# EAGLE design Edgy (EAGLE 9.0.0)
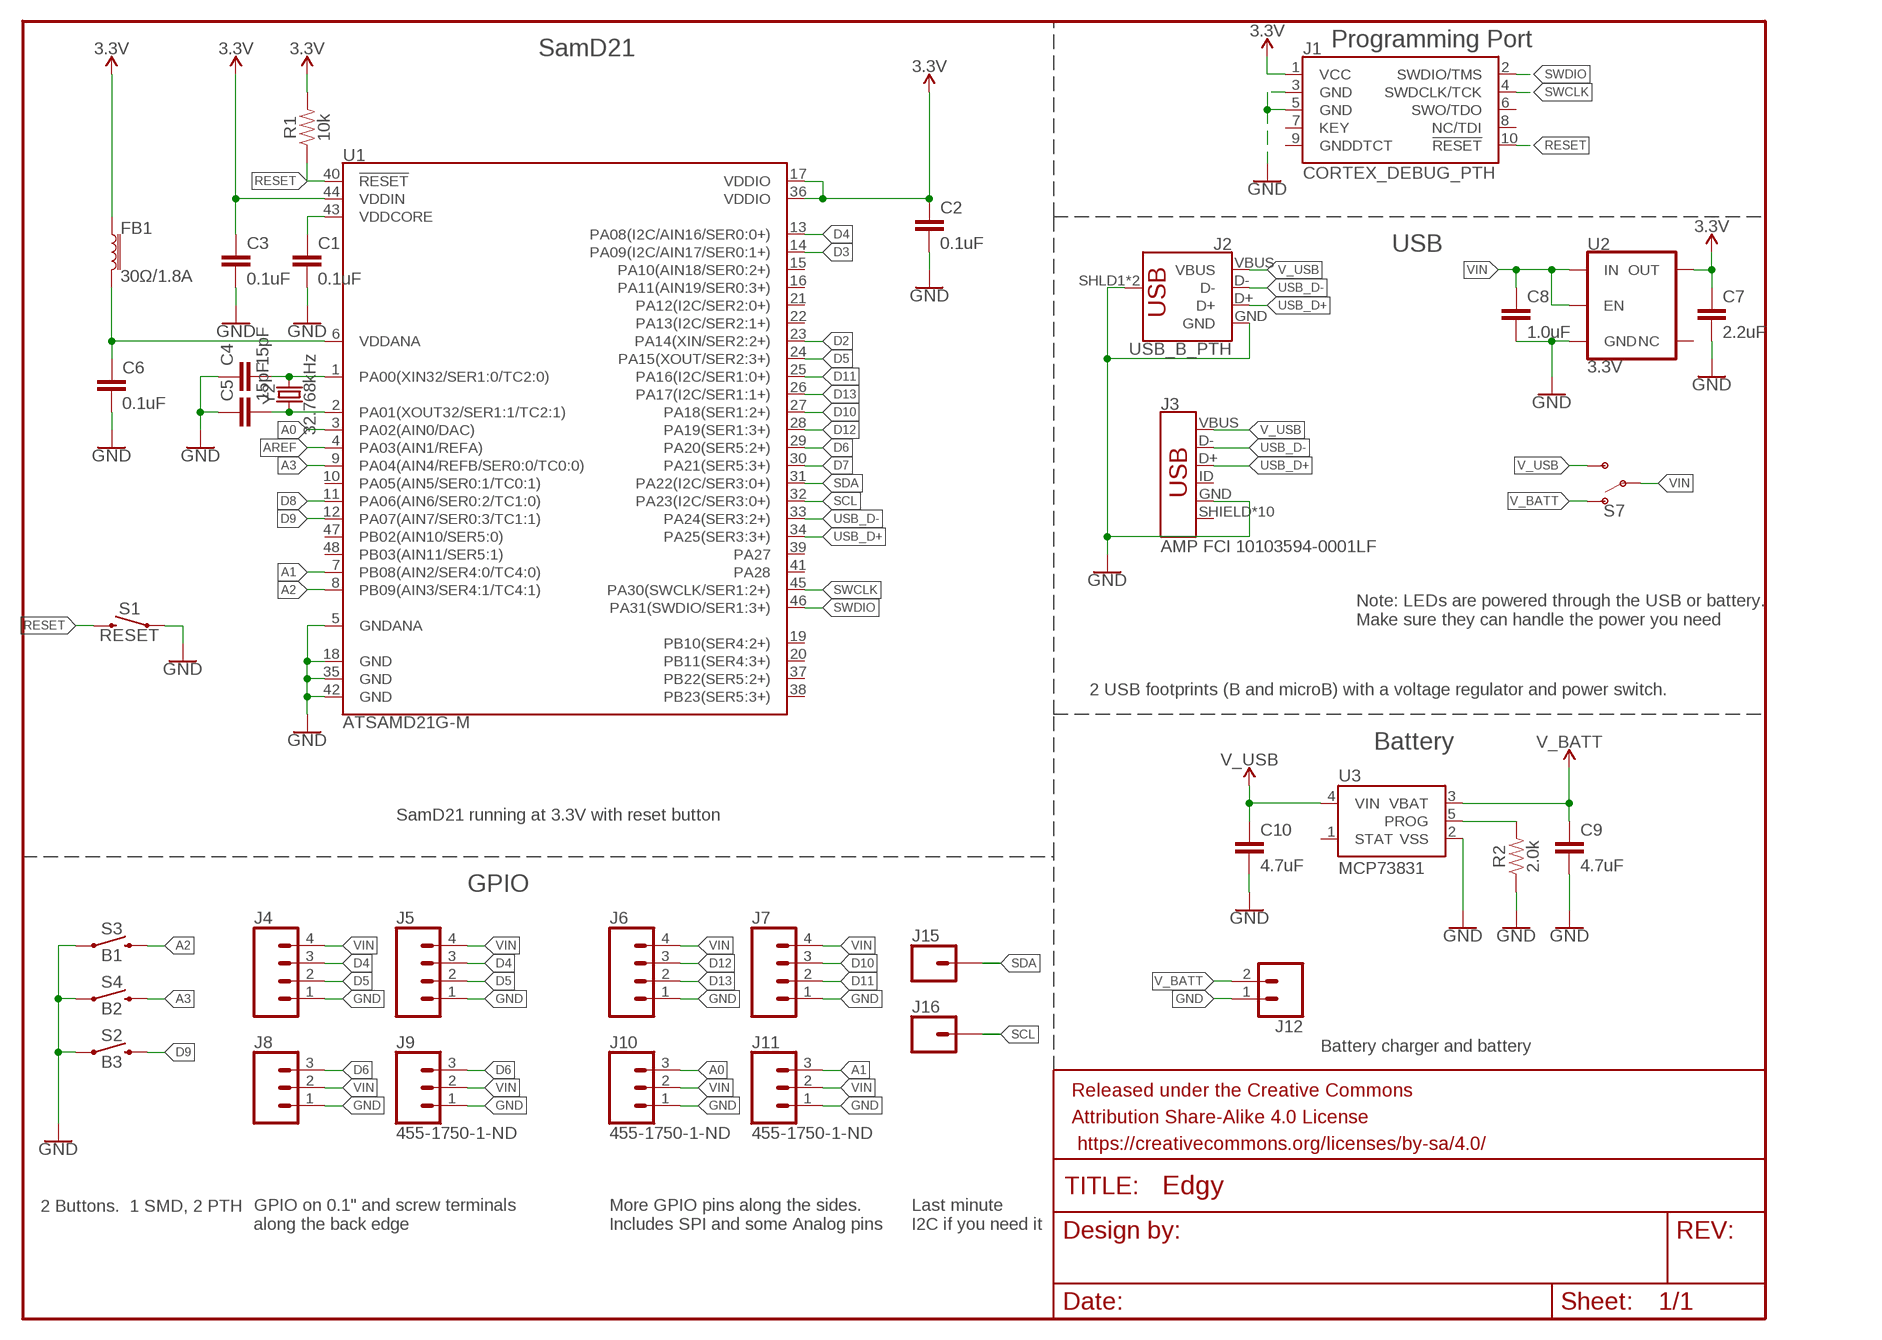
[diagram p0: schematic, sheet 1]

## Parts
C1  0.1uF  0.1UF-0402-16V-10%  [0402]
C2  0.1uF  0.1UF-0402-16V-10%  [0402]
C3  0.1uF  0.1UF-0402-16V-10%  [0402]
C4  15pF  15PF-0402-50V-5%  [0402]
C5  15pF  15PF-0402-50V-5%  [0402]
C6  0.1uF  0.1UF-0402-16V-10%  [0402]
C7  2.2uF  2.2UF-0603-10V-20%  [0603]
C8  1.0uF  1.0UF-0402-16V-10%  [0402]
C9  4.7uF  4.7UF-0603-6.3V-(10%)  [0603]
C10  4.7uF  4.7UF-0603-6.3V-(10%)  [0603]
FB1  30Ω/1.8A  FERRITE_BEAD-0603  [0603]
FRAME1  FRAME-LETTER  [CREATIVE_COMMONS]
J1  CORTEX_DEBUG_PTH  [2X5-PTH-1.27MM]
J2  USB_B_PTH  [USB-B-PTH]
J3  AMP FCI 10103594-0001LF  USB_MICRO-B_HALF_PTH_MILL  [USB-MICROB-PTH-MILL]
J4  CONN_04SCREW  [SCREWTERMINAL-3.5MM-4]
J5  CONN_04  [1X04]
J6  CONN_04  [1X04]
J7  CONN_04  [1X04]
J8  CONN_03SCREW  [SCREWTERMINAL-3.5MM-3]
J9  455-1750-1-ND  CONN_03  [1X03]
J10  455-1750-1-ND  CONN_03  [1X03]
J11  455-1750-1-ND  CONN_03  [1X03]
J12  CONN_02-JST-2MM-SMT  [JST-2-SMD]
J15  CONN_01  [1X01]
J16  CONN_01  [1X01]
R1  10k  10KOHM-0603-1/10W-1%  [0603]
R2  2.0k  2.0KOHM-0603-1/10W-5%  [0603]
S1  RESET  MOMENTARY-SWITCH-SPST-SMD-6.0X3.5MM  [TACTILE_SWITCH_SMD_6.0X3.5MM]
S2  B3  MOMENTARY-SWITCH-SPST-SMD-6.0X3.5MM  [TACTILE_SWITCH_SMD_6.0X3.5MM]
S3  B1  MOMENTARY-SWITCH-SPST-PTH-RIGHT-ANGLE-KIT  [TACTILE_SWITCH_PTH_RIGHT_ANGLE_KIT]
S4  B2  MOMENTARY-SWITCH-SPST-PTH-RIGHT-ANGLE-KIT  [TACTILE_SWITCH_PTH_RIGHT_ANGLE_KIT]
S7  SWITCH-SPDT-PTH-11.6X4.0MM  [SWITCH_SPDT_PTH_11.6X4.0MM]
U1  ATSAMD21G-M  [QFN-48]
U2  3.3V  V_REG_AP2112K-3.3V  [SOT23-5]
U3  MCP73831  [SOT23-5]
Y2  32.768kHz  CRYSTAL-32.768KHZSMD-3.2X1.5  [CRYSTAL-SMD-3.2X1.5MM]

## Nets
3.3V: C2.1 C3.1 C7.1 FB1.1 J1.1(VCC) R1.2 U1.17(VDDIO) U1.36(VDDIO) U1.44(VDDIN) U2.5(OUT)
A0: J10.3 U1.3(PA02(AIN0/DAC))
A1: J11.3 U1.7(PB08(AIN2/SER4:0/TC4:0))
A2: S3.2 U1.8(PB09(AIN3/SER4:1/TC4:1))
A3: S4.2 U1.9(PA04(AIN4/REFB/SER0:0/TC0:0))
AREF: U1.4(PA03(AIN1/REFA))
D2: U1.23(PA14(XIN/SER2:2+))
D3: U1.14(PA09(I2C/AIN17/SER0:1+))
D4: J4.3 J5.3 U1.13(PA08(I2C/AIN16/SER0:0+))
D5: J4.2 J5.2 U1.24(PA15(XOUT/SER2:3+))
D6: J8.3 J9.3 U1.29(PA20(SER5:2+))
D7: U1.30(PA21(SER5:3+))
D8: U1.11(PA06(AIN6/SER0:2/TC1:0))
D9: S2.2 U1.12(PA07(AIN7/SER0:3/TC1:1))
D10: J7.3 U1.27(PA18(SER1:2+))
D11: J7.2 U1.25(PA16(I2C/SER1:0+))
D12: J6.3 U1.28(PA19(SER1:3+))
D13: J6.2 U1.26(PA17(I2C/SER1:1+))
GND: C1.2 C2.2 C3.2 C4.1 C5.1 C6.2 C7.2 C8.2 C9.2 C10.2 J1.3(GND) J1.5(GND) J2.GND J2.SHLD1(SHIELD) J2.SHLD2(SHIELD) J3.GND J4.1 J5.1 J6.1 J7.1 J8.1 J9.1 J10.1 J11.1 J12.1 R2.1 S1.1 S2.1 S3.1 S4.1 U1.5(GNDANA) U1.18(GND) U1.35(GND) U1.42(GND) U2.2(GND) U3.2(VSS)
N$1: R2.2 U3.5(PROG)
N$2: C6.1 FB1.2 U1.6(VDDANA)
N$3: C1.1 U1.43(VDDCORE)
N$4: C4.2 U1.1(PA00(XIN32/SER1:0/TC2:0)) Y2.P$2
N$5: C5.2 U1.2(PA01(XOUT32/SER1:1/TC2:1)) Y2.P$1
RESET: J1.10(!RESET) R1.1 S1.2 U1.40(!RESET!)
SCL: J16.1 U1.32(PA23(I2C/SER3:0+))
SDA: J15.1 U1.31(PA22(I2C/SER3:0+))
SWCLK: J1.4(SWDCLK/TCK) U1.45(PA30(SWCLK/SER1:2+))
SWDIO: J1.2(SWDIO/TMS) U1.46(PA31(SWDIO/SER1:3+))
USB_D+: J2.D+ J3.D+ U1.34(PA25(SER3:3+))
USB_D-: J2.D- J3.D- U1.33(PA24(SER3:2+))
V_BATT: C9.1 J12.2 S7.1(O) U3.3(VBAT)
V_USB: C10.1 J2.VBUS J3.VBUS S7.3(S) U3.4(VIN)
VIN: C8.1 J4.4 J5.4 J6.4 J7.4 J8.2 J9.2 J10.2 J11.2 S7.2(P) U2.1(IN) U2.3(EN)
Unconnected: J1.6(SWO/TDO) J1.7(KEY) J1.8(NC/TDI) J1.9(GNDDTCT) J3.ID J3.SHIELD J3.SHIELD2(SHIELD) J3.SHIELD3(SHIELD) J3.SHIELD4(SHIELD) J3.SHIELD5(SHIELD) J3.SHIELD6(SHIELD) J3.SHIELD7(SHIELD) J3.SHIELD8(SHIELD) J3.SHIELD9(SHIELD) J3.SHIELD10(SHIELD) U1.10(PA05(AIN5/SER0:1/TC0:1)) U1.15(PA10(AIN18/SER0:2+)) U1.16(PA11(AIN19/SER0:3+)) U1.19(PB10(SER4:2+)) U1.20(PB11(SER4:3+)) U1.21(PA12(I2C/SER2:0+)) U1.22(PA13(I2C/SER2:1+)) U1.37(PB22(SER5:2+)) U1.38(PB23(SER5:3+)) U1.39(PA27) U1.41(PA28) U1.47(PB02(AIN10/SER5:0)) U1.48(PB03(AIN11/SER5:1)) U2.4(NC) U3.1(STAT)

## Notes on the sheet
- Programming Port
- SamD21
- USB
- Note: LEDs are powered through the USB or battery.  
  Make sure they can handle the power you need
- 2 USB footprints (B and microB) with a voltage regulator and power switch.
- Battery
- SamD21 running at 3.3V with reset button
- GPIO
- Battery charger and battery
- 2 Buttons.  1 SMD, 2 PTH
- GPIO on 0.1" and screw terminals 
  along the back edge
- More GPIO pins along the sides.
  Includes SPI and some Analog pins
- Last minute 
  I2C if you need it

## Library data of the parts
C1-C3 C6 = SparkFun-Capacitors:0.1UF: 0.1µF ceramic capacitors A capacitor is a passive two-terminal electrical component used to store electrical energy temporarily in an electric field.; PROD_ID: CAP-12416
C4 C5 = SparkFun-Capacitors:15PF: 15pF ceramic capacitors A capacitor is a passive two-terminal electrical component used to store electrical energy temporarily in an electric field.; PROD_ID: CAP-13063
C7 = SparkFun-Capacitors:2.2UF: 2.2µF ceramic capacitors A capacitor is a passive two-terminal electrical component used to store electrical energy temporarily in an electric field.; PROD_ID: CAP-07888
C8 = SparkFun-Capacitors:1.0UF: 1µF ceramic capacitors A capacitor is a passive two-terminal electrical component used to store electrical energy temporarily in an electric field.; PROD_ID: CAP-12417
C9 C10 = SparkFun-Capacitors:4.7UF: 4.7µF ceramic capacitors A capacitor is a passive two-terminal electrical component used to store electrical energy temporarily in an electric field.; PROD_ID: CAP-08280
FB1 = SparkFun-Coils:FERRITE_BEAD: Ferrite Bead (blocks, cores, rings, chokes, etc.) Inductor with layers of ferrite used to suppress high frequencies. Often used to isolate high frequency noise. SparkFun Products: IOIO-OTG - V2.2 <https://www.sparkfun.com/products/13613> SparkFun SAMD21 Mini Breakout <https://www.sparkfun.com/products/13664> SparkFun 6 Degrees of Freedom Breakout - LSM6DS3 <https://www.sparkfun.com/products/13339> SparkFun SAMD21 Dev Breakout <https://www.sparkfun.com/products/13672>; PROD_ID: NDUC-13805
FRAME1 = SparkFun-Aesthetics:FRAME-LETTER: Schematic Frame - Letter Standard 8.5x11 US Letter frame
J1 = SparkFun-Connectors:CORTEX_DEBUG: Cortex Debug Connector - 10 pin Supports JTAG debug, Serial Wire debug, and Serial Wire Viewer. PTH and SMD connector options available. General Connector Information <http://infocenter.arm.com/help/topic/com.arm.doc.faqs/attached/13634/cortex_debug_connectors.pdf> Products: PTH Connector <http://www.digikey.com/product-detail/en/cnc-tech/3220-10-0100-00/1175-1627-ND/3883661> -via Digi-Key SparkFun PSoc <https://www.sparkfun.com/products/13229> SparkFun T <https://www.sparkfun.com/products/13810>
J2 = SparkFun-Connectors:USB_B: USB Type B Connector SparkFun Products: SparkFun Stepoko <https://www.sparkfun.com/products/13899> PTH; PROD_ID: CONN-08278; SF_ID: PRT-00139
J3 = SparkFun-Connectors:USB_MICRO-B: USB Type Micro-B Connector Male/female and PTH/SMT variants SparkFun Products: SparkFun microB USB Breakout <https://www.sparkfun.com/products/12035> SparkFun USB microB Plug Breakout <https://www.sparkfun.com/products/10031> SparkFun ESP8266 Thing <https://www.sparkfun.com/products/13231>; PROD_ID: CONN-13711
J4 = SparkFun-Connectors:CONN_04: Multi connection point. Often used as Generic Header-pin footprint for 0.1 inch spaced/style header connections On any of the 0.1 inch spaced packages, you can populate with these: Break Away Headers - Straight <https://www.sparkfun.com/products/116> (PRT-00116) Break Away Male Headers - Right Angle <https://www.sparkfun.com/products/553> (PRT-00553) Female Headers <https://www.sparkfun.com/products/115> (PRT-00115) Break Away Headers - Machine Pin <https://www.sparkfun.com/products/117> (PRT-00117) Break Away Female Headers - Swiss Machine Pin <https://www.sparkfun.com/products/743> (PRT-00743) For SCREWTERMINALS and SPRING TERMINALS visit here: Screw Terimnals on SparkFun.com <https://www.sparkfun.com/search/results?term=Screw+Terminals> (5mm/3.5mm/2.54mm spacing) This device is also useful as a general connection point to wire up your design to another part of your project. Our various solder wires solder well into these plated through hole pads. Hook-Up Wire - Assortment (Stranded, 22 AWG) <https://www.sparkfun.com/products/11375> (PRT-11375) Hook-Up Wire - Assortment (Solid Core, 22 AWG) <https://www.sparkfun.com/products/11367> (PRT-11367) View the entire wire category on our website here <https://www.sparkfun.com/categories/141> Special notes: Molex polarized connector foot print use with SKU : PRT-08231 with associated crimp pins and housings. 1MM SMD Version SKU: PRT-10208; PROD_ID: 2xCONN-08399; SF_ID: 2xPRT-08084
J5-J7 = SparkFun-Connectors:CONN_04: Multi connection point. Often used as Generic Header-pin footprint for 0.1 inch spaced/style header connections On any of the 0.1 inch spaced packages, you can populate with these: Break Away Headers - Straight <https://www.sparkfun.com/products/116> (PRT-00116) Break Away Male Headers - Right Angle <https://www.sparkfun.com/products/553> (PRT-00553) Female Headers <https://www.sparkfun.com/products/115> (PRT-00115) Break Away Headers - Machine Pin <https://www.sparkfun.com/products/117> (PRT-00117) Break Away Female Headers - Swiss Machine Pin <https://www.sparkfun.com/products/743> (PRT-00743) For SCREWTERMINALS and SPRING TERMINALS visit here: Screw Terimnals on SparkFun.com <https://www.sparkfun.com/search/results?term=Screw+Terminals> (5mm/3.5mm/2.54mm spacing) This device is also useful as a general connection point to wire up your design to another part of your project. Our various solder wires solder well into these plated through hole pads. Hook-Up Wire - Assortment (Stranded, 22 AWG) <https://www.sparkfun.com/products/11375> (PRT-11375) Hook-Up Wire - Assortment (Solid Core, 22 AWG) <https://www.sparkfun.com/products/11367> (PRT-11367) View the entire wire category on our website here <https://www.sparkfun.com/categories/141> Special notes: Molex polarized connector foot print use with SKU : PRT-08231 with associated crimp pins and housings. 1MM SMD Version SKU: PRT-10208; PROD_ID: CONN-09696
J8 = SparkFun-Connectors:CONN_03: Multi connection point. Often used as Generic Header-pin footprint for 0.1 inch spaced/style header connections On any of the 0.1 inch spaced packages, you can populate with these: Break Away Headers - Straight <https://www.sparkfun.com/products/116> (PRT-00116) Break Away Male Headers - Right Angle <https://www.sparkfun.com/products/553> (PRT-00553) Female Headers <https://www.sparkfun.com/products/115> (PRT-00115) Break Away Headers - Machine Pin <https://www.sparkfun.com/products/117> (PRT-00117) Break Away Female Headers - Swiss Machine Pin <https://www.sparkfun.com/products/743> (PRT-00743) Stackable Header - 3 Pin (Female, 0.1") <https://www.sparkfun.com/products/13875> (PRT-13875) For SCREWTERMINALS and SPRING TERMINALS visit here: Screw Terimnals on SparkFun.com <https://www.sparkfun.com/search/results?term=Screw+Terminals> (5mm/3.5mm/2.54mm spacing) This device is also useful as a general connection point to wire up your design to another part of your project. Our various solder wires solder well into these plated through hole pads. Hook-Up Wire - Assortment (Stranded, 22 AWG) <https://www.sparkfun.com/products/11375> (PRT-11375) Hook-Up Wire - Assortment (Solid Core, 22 AWG) <https://www.sparkfun.com/products/11367> (PRT-11367) View the entire wire category on our website here <https://www.sparkfun.com/categories/141> Special notes: Molex polarized connector foot print use with SKU : PRT-08232 with associated crimp pins and housings.; PROD_ID: CONN-08288; SF_ID: PRT-08235
J9-J11 = SparkFun-Connectors:CONN_03: Multi connection point. Often used as Generic Header-pin footprint for 0.1 inch spaced/style header connections On any of the 0.1 inch spaced packages, you can populate with these: Break Away Headers - Straight <https://www.sparkfun.com/products/116> (PRT-00116) Break Away Male Headers - Right Angle <https://www.sparkfun.com/products/553> (PRT-00553) Female Headers <https://www.sparkfun.com/products/115> (PRT-00115) Break Away Headers - Machine Pin <https://www.sparkfun.com/products/117> (PRT-00117) Break Away Female Headers - Swiss Machine Pin <https://www.sparkfun.com/products/743> (PRT-00743) Stackable Header - 3 Pin (Female, 0.1") <https://www.sparkfun.com/products/13875> (PRT-13875) For SCREWTERMINALS and SPRING TERMINALS visit here: Screw Terimnals on SparkFun.com <https://www.sparkfun.com/search/results?term=Screw+Terminals> (5mm/3.5mm/2.54mm spacing) This device is also useful as a general connection point to wire up your design to another part of your project. Our various solder wires solder well into these plated through hole pads. Hook-Up Wire - Assortment (Stranded, 22 AWG) <https://www.sparkfun.com/products/11375> (PRT-11375) Hook-Up Wire - Assortment (Solid Core, 22 AWG) <https://www.sparkfun.com/products/11367> (PRT-11367) View the entire wire category on our website here <https://www.sparkfun.com/categories/141> Special notes: Molex polarized connector foot print use with SKU : PRT-08232 with associated crimp pins and housings.; PROD_ID: XXX-00000
J12 = SparkFun-Connectors:CONN_02: Multi connection point. Often used as Generic Header-pin footprint for 0.1 inch spaced/style header connections On any of the 0.1 inch spaced packages, you can populate with these: Break Away Headers - Straight <https://www.sparkfun.com/products/116> (PRT-00116) Break Away Male Headers - Right Angle <https://www.sparkfun.com/products/553> (PRT-00553) Female Headers <https://www.sparkfun.com/products/115> (PRT-00115) Break Away Headers - Machine Pin <https://www.sparkfun.com/products/117> (PRT-00117) Break Away Female Headers - Swiss Machine Pin <https://www.sparkfun.com/products/743> (PRT-00743) For SCREWTERMINALS and SPRING TERMINALS visit here: Screw Terimnals on SparkFun.com <https://www.sparkfun.com/search/results?term=Screw+Terminals> (5mm/3.5mm/2.54mm spacing) This device is also useful as a general connection point to wire up your design to another part of your project. Our various solder wires solder well into these plated through hole pads. Hook-Up Wire - Assortment (Stranded, 22 AWG) <https://www.sparkfun.com/products/11375> (PRT-11375) Hook-Up Wire - Assortment (Solid Core, 22 AWG) <https://www.sparkfun.com/products/11367> (PRT-11367) View the entire wire category on our website here <https://www.sparkfun.com/categories/141> Special notes: Molex polarized connector foot print use with: PRT-08233 with associated crimp pins and housings. 2.54_SCREWTERM for use with PRT-10571. 3.5mm Screw Terminal footprints for PRT-08084 5mm Screw Terminal footprints for use with PRT-08432; PROD_ID: CONN-11443
J15 J16 = SparkFun-Connectors:CONN_01: Single connection point. Often used as Generic Header-pin footprint for 0.1 inch spaced/style header connections On any of the 0.1 inch spaced packages, you can populate with these: Break Away Headers - Straight <https://www.sparkfun.com/products/116> (PRT-00116) Break Away Male Headers - Right Angle <https://www.sparkfun.com/products/553> (PRT-00553) Female Headers <https://www.sparkfun.com/products/115> (PRT-00115) Break Away Headers - Machine Pin <https://www.sparkfun.com/products/117> (PRT-00117) Break Away Female Headers - Swiss Machine Pin <https://www.sparkfun.com/products/743> (PRT-00743) This device is also useful as a general connection point to wire up your design to another part of your project. Our various solder wires solder well into these plated through hole pads. Hook-Up Wire - Assortment (Stranded, 22 AWG) <https://www.sparkfun.com/products/11375> (PRT-11375) Hook-Up Wire - Assortment (Solid Core, 22 AWG) <https://www.sparkfun.com/products/11367> (PRT-11367) View the entire wire category on our website here <https://www.sparkfun.com/categories/141> Special notes: SMTSO-256-ET is a "flush mount" nut for a 4-40 screw. We mostly use this on specialty testbeds; it is a nice way to connect hardware to your PCB at an adjustable hieght. Also note, the SNAP packages are for using a snappable style connector. We sell a baggie of snaps and they are also used on two LilyPad designs: Snap Assortment - 30 pack (male and female) <https://www.sparkfun.com/products/11347> (DEV-11347) LilyPad Arduino SimpleSnap <https://www.sparkfun.com/products/10941> (DEV-10941) LilyPad SimpleSnap Protoboard <https://www.sparkfun.com/products/10940> (DEV-10940)
R1 = SparkFun-Resistors:10KOHM: 10kΩ resistor A resistor is a passive two-terminal electrical component that implements electrical resistance as a circuit element. Resistors act to reduce current flow, and, at the same time, act to lower voltage levels within circuits. - Wikipedia; PROD_ID: RES-00824
R2 = SparkFun-Resistors:2.0KOHM: 2kΩ resistor A resistor is a passive two-terminal electrical component that implements electrical resistance as a circuit element. Resistors act to reduce current flow, and, at the same time, act to lower voltage levels within circuits. - Wikipedia; PROD_ID: RES-08296
S1 S2 = SparkFun-Switches:MOMENTARY-SWITCH-SPST: Momentary Switch (Pushbutton) - SPST Normally-open (NO) SPST momentary switches (buttons, pushbuttons). Variants PTH-12MM - 12mm square, through-hole Momentary Pushbutton Switch - 12mm Square <https://www.sparkfun.com/products/9190> (COM-09190) PTH-6.0MM, PTH-6.0MM-KIT - 6.0mm square, through-hole Mini Pushbutton Switch <https://www.sparkfun.com/products/97> (COM-00097) KIT package intended for soldering kit's - only one side of pads' copper is exposed. PTH-RIGHT-ANGLE-KIT - Right-angle, through-hole Right Angle Tactile Button <https://www.sparkfun.com/products/10791> - Used on SparkFun BigTime Watch Kit <https://www.sparkfun.com/products/11734> SMD-12MM - 12mm square, surface-mount Tactile Button - SMD (12mm) <https://www.sparkfun.com/products/12993> (COM-12993) Used on SparkFun PicoBoard <https://www.sparkfun.com/products/11888> SMD-4.5MM - 4.5mm Square Trackball Switch Used on SparkFun Blackberry Trackballer Breakout <https://www.sparkfun.com/products/13169> SMD-4.6MMX2.8MM - 4.60mm x 2.80mm, surface mount Used on SparkFun SAMD21 Mini Breakout <https://www.sparkfun.com/products/13664> SMD-5.2MM, SMD-5.2-REDUNDANT - 5.2mm square, surface-mount Mini Pushbutton Switch - SMD <https://www.sparkfun.com/products/8720> (COM-08720) Used on Arduino Pro Mini <https://www.sparkfun.com/products/11114> REDUNDANT package connects both switch circuits together SMD-6.0X3.5MM - 6.0 x 3.5mm, surface mount Momentary Reset Switch SMD <https://www.sparkfun.com/products/8229> (COM-08229) SMD-6.2MM-TALL - 6.2mm square, surface mount Tactile Button - SMD (6mm) <https://www.sparkfun.com/products/12992> Used on SparkFun Digital Sandbox <https://www.sparkfun.com/products/12651> SMD-RIGHT-ANGLE - Right-angle, surface mount Used on SparkFun Block for Intel® Edison - Arduino <https://www.sparkfun.com/products/13036>; PROD_ID: SWCH-00815; SF_SKU: COM-08229
S3 S4 = SparkFun-Switches:MOMENTARY-SWITCH-SPST: Momentary Switch (Pushbutton) - SPST Normally-open (NO) SPST momentary switches (buttons, pushbuttons). Variants PTH-12MM - 12mm square, through-hole Momentary Pushbutton Switch - 12mm Square <https://www.sparkfun.com/products/9190> (COM-09190) PTH-6.0MM, PTH-6.0MM-KIT - 6.0mm square, through-hole Mini Pushbutton Switch <https://www.sparkfun.com/products/97> (COM-00097) KIT package intended for soldering kit's - only one side of pads' copper is exposed. PTH-RIGHT-ANGLE-KIT - Right-angle, through-hole Right Angle Tactile Button <https://www.sparkfun.com/products/10791> - Used on SparkFun BigTime Watch Kit <https://www.sparkfun.com/products/11734> SMD-12MM - 12mm square, surface-mount Tactile Button - SMD (12mm) <https://www.sparkfun.com/products/12993> (COM-12993) Used on SparkFun PicoBoard <https://www.sparkfun.com/products/11888> SMD-4.5MM - 4.5mm Square Trackball Switch Used on SparkFun Blackberry Trackballer Breakout <https://www.sparkfun.com/products/13169> SMD-4.6MMX2.8MM - 4.60mm x 2.80mm, surface mount Used on SparkFun SAMD21 Mini Breakout <https://www.sparkfun.com/products/13664> SMD-5.2MM, SMD-5.2-REDUNDANT - 5.2mm square, surface-mount Mini Pushbutton Switch - SMD <https://www.sparkfun.com/products/8720> (COM-08720) Used on Arduino Pro Mini <https://www.sparkfun.com/products/11114> REDUNDANT package connects both switch circuits together SMD-6.0X3.5MM - 6.0 x 3.5mm, surface mount Momentary Reset Switch SMD <https://www.sparkfun.com/products/8229> (COM-08229) SMD-6.2MM-TALL - 6.2mm square, surface mount Tactile Button - SMD (6mm) <https://www.sparkfun.com/products/12992> Used on SparkFun Digital Sandbox <https://www.sparkfun.com/products/12651> SMD-RIGHT-ANGLE - Right-angle, surface mount Used on SparkFun Block for Intel® Edison - Arduino <https://www.sparkfun.com/products/13036>; PROD_ID: CONN-10672; SF_SKU: COM-10791
S7 = SparkFun-Switches:SWITCH-SPDT: Single Pole, Double Throw (SPDT) Switch Single-pole, double-throw (SPDT) switch. Variant Overview SMD-AYZ0202 Surface Mount DPDT Switch <https://www.sparkfun.com/products/597> (COM-00597) Used on e.g. LilyPad Arduino USB - ATmega32U4 Board <https://www.sparkfun.com/products/12049> PTH-11.6X4.0MM SPDT Mini Power Switch <https://www.sparkfun.com/products/102> (COM-00102) Used on e.g. SparkFun Simon Says - Through-Hole Soldering Kit <https://www.sparkfun.com/products/10547> (KIT-10547) PTH-11.6X4.0MM-KIT KIT version of SPDT Mini Power Switch - Simplifies soldering by removing tStop of switch pins - only one side can be soldered. PTH-11.6X4.0MM-LOCK LOCK version of SPDT Mini Power Switch - Offset pins hold switch in place for easier soldering. SMD-RIGHT-ANGLE Surface Mount Right Angle Switch <https://www.sparkfun.com/products/10860> (COM-10860) Used on e.g. SparkFun ESP8266 Thing <https://www.sparkfun.com/products/13231>; PROD_ID: SWCH-08261; SF_SKU: COM-00102
U1 = SparkFun-IC-Microcontroller:ATSAMD21G: Atmel SAMD21G SMART ARM-Based Microcontroller The Atmel ® | SMART ™ SAM D21 is a series of low-power microcontrollers using the 32-bit ARM ® Cortex ® -M0+ processor, and ranging from 32- to 64-pins with up to 256KB Flash and 32KB of SRAM. The SAM D21 devices operate at a maximum frequency of 48MHz and reach 2.46 CoreMark/MHz. They are designed for simple and intuitive migration with identical peripheral modules, hex compatible code, identical linear address map and pin compatible migration paths between all devices in the product series. All devices include intelligent and flexible peripherals, Atmel Event System for inter-peripheral signaling, and support for capacitive touch button, slider and wheel user interfaces. Datasheet <https://cdn.sparkfun.com/datasheets/Dev/Arduino/Boards/Atmel-42181-SAM-D21_Datasheet.pdf> SparkFun Products SparkFun SAMD21 Mini Breakout <https://www.sparkfun.com/products/13664> (DEV-13664) SparkFun SAMD21 Dev Breakout <https://www.sparkfun.com/products/13672> (DEV-13672); PROD_ID: IC-13064
U2 = SparkFun-IC-Power:V_REG_AP2112: AP2112 - 600mA CMOS LDO Regulator w/ Enable The AP2112 is CMOS process low dropout linear regulator with enable function, the regulator delivers a guaranteed 600mA (min.) continuous load current. Features Output Voltage Accuracy: ±1.5% Output Current: 600mA (Min.) Foldback Short Current Protection: 50mA Enable Function to Turn ON/OFF VOUT Low Dropout Voltage (3.3V): 250mV (Typ.) @IOUT=600mA Excellent Load Regulation: 0.2%/A (Typ.) Excellent Line Regulation: 0.02%/V (Typ.) Low Quiescent Current: 55μA (Typ.) Low Standby Current: 0.01μA (Typ.) Low Output Noise: 50μVRMS PSRR: 100Hz -65dB, 1kHz -65dB OTSD Protection Stable with 1.0μF Flexible Cap: Ceramic, Tantalum and Aluminum Electrolytic Operation Temperature Range: -40°C to 85°C ESD: MM 400V, HBM 4000V; PROD_ID: VREG-12457
U3 = SparkFun-IC-Power:MCP73831: MCP73831T Li-Ion, Li-Pol Controller Miniature single cell, fully integrated Li-Ion, Li-polymer charge management controller Datasheet <http://ww1.microchip.com/downloads/en/DeviceDoc/20001984g.pdf> SparkFun Products: SparkFun ESP32 Thing <https://www.sparkfun.com/products/13907> SparkFun 9DoF Razor IMU M0 <https://www.sparkfun.com/products/14001>; PROD_ID: IC-09995
Y2 = SparkFun-Clocks:CRYSTAL-32.768KHZ: 32.768kHz Crystal Frequency: 32.768kHz Frequency Stability: ±20ppm Load Capacitance: 12.5pF (PTH-2X6 & SMD-3.2X1.5), 6pF (SMD-2X6) SparkFun Products: SparkFun BigTime Watch Kit <https://www.sparkfun.com/products/11734> SparkFun nRF52832 Breakout <https://www.sparkfun.com/products/13990> SparkFun Real Time Clock Module <https://www.sparkfun.com/products/12708>; PROD_ID: XTAL-13062

## Board
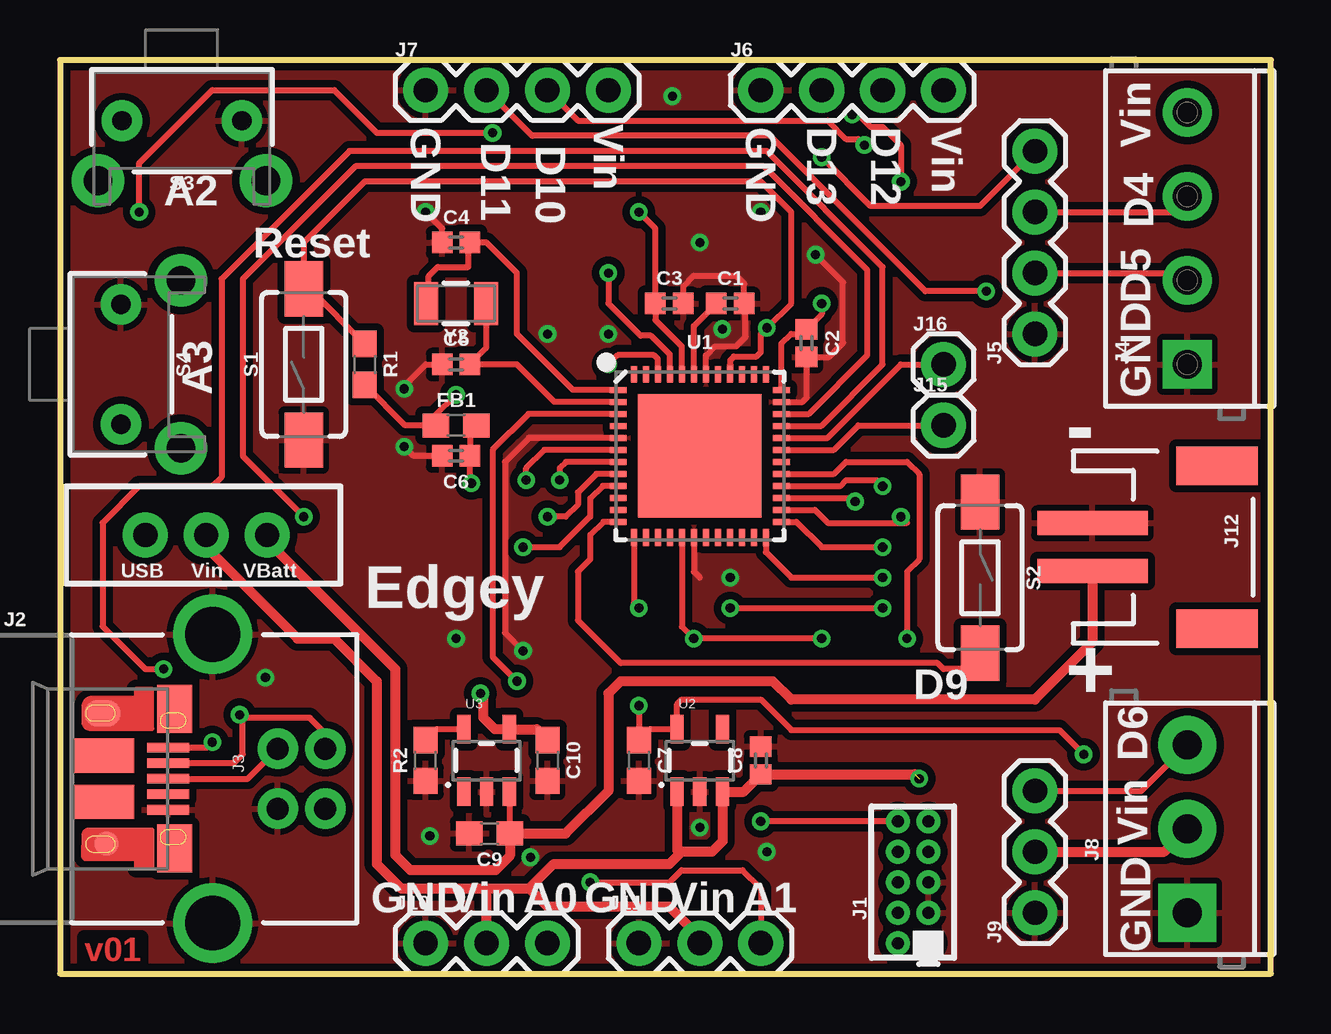
[diagram p1: board, top side]
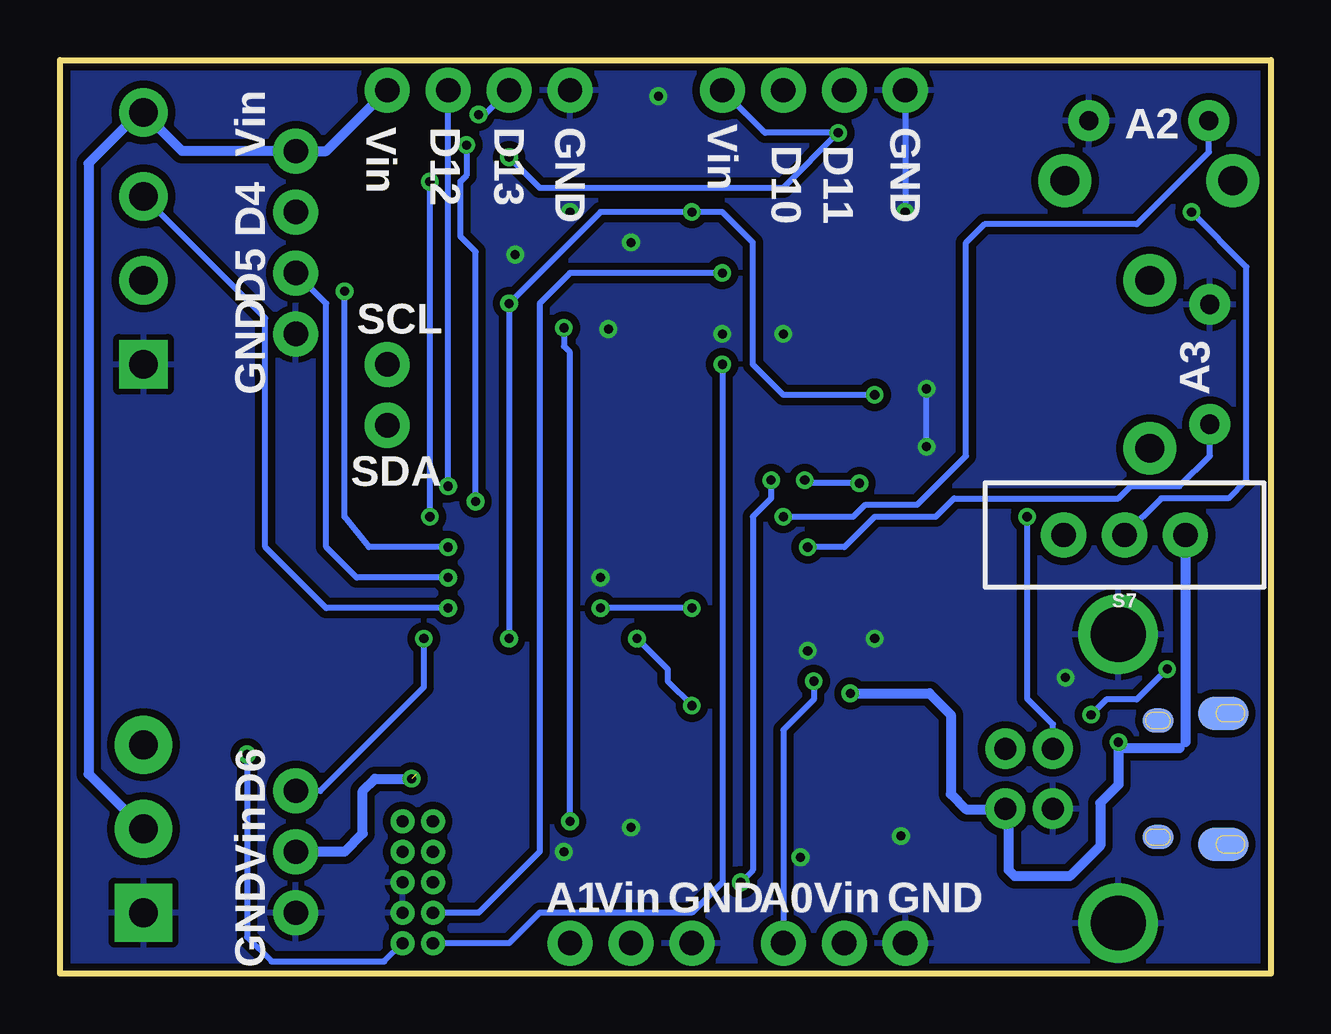
[diagram p2: board, bottom side, seen from below]

Size 50.47 x 38.09 mm. Coordinates in mm from the lower left corner, seen from the top.
Outline: 0,0 50.47,0 50.47,38.09 0,38.09 0,0
Copper layers (1*16): Top 0.035mm / dielectric 1.5mm / Bottom 0.035mm
Design rules "SparkFun-2-layer-TIGHT": minimum track width 7mil, minimum drill 15mil, track to track 7mil, track to pad 7mil, pad to pad 7mil, via to via 7mil, smd to smd 7mil, copper to edge 7mil, drill to drill 7mil, minimum pad ring 7mil, minimum via ring 7mil, stop-mask expansion 4mil, vias tented up to drill 25mil, thermal gap 10mil

### Footprints (pad centres in the part's own frame; a part is rotated, then mirrored left to right if it is on the bottom)
0402 = smd 0.85 x 0.9: 1 -0.58,0; 2 0.58,0
0603 = smd 1.1 x 1: 1 -0.85,0; 2 0.85,0
2X5-PTH-1.27MM = drill 0.508 pad 1: 1 -2.54,-0.635; 2 -2.54,0.635; 3 -1.27,-0.635; 4 -1.27,0.635; 5 0,-0.635; 6 0,0.635; 7 1.27,-0.635; 8 1.27,0.635; 9 2.54,-0.635; 10 2.54,0.635
USB-B-PTH = drill 0.914 pad 1.676: D+ 4,1.25; D- 5.981,1.25; GND 4,-1.25; VBUS 5.981,-1.25 | drill 2.286: SHLD1 1.282,-6.02; SHLD2 1.282,6.02
USB-MICROB-PTH-MILL = smd 0.4 x 1.75: D+ 0,0; D- -0.65,0; GND 1.3,0; ID 0.65,0; VBUS -1.3,0 | smd 2 x 1.46: SHIELD -2.9,0.275; SHIELD2 2.9,0.275 | smd 1.425 x 2.5: SHIELD3 -0.963,-2.675; SHIELD4 0.963,-2.675 | smd 1.4 x 2.1 bottom: SHIELD5 -2.731,-2.531; SHIELD7 2.729,-2.531 | smd 1 x 1: SHIELD6 2.7,-2.575 | smd 1.1 x 1.5: SHIELD8 -2.731,-2.731 | smd 1 x 1.3 bottom: SHIELD9 -2.43,0.195; SHIELD10 2.43,0.195
SCREWTERMINAL-3.5MM-4 = drill 1.2 pad 2.032 square: 1 0,0 | drill 1.2 pad 2.032: 2 3.5,0; 3 7,0; 4 10.5,0
1X04 = drill 1.016 pad 1.88: 1 0,0; 2 2.54,0; 3 5.08,0; 4 7.62,0
SCREWTERMINAL-3.5MM-3 = drill 1.2 pad 2.413 square: 1 0,0 | drill 1.2 pad 2.413: 2 3.5,0; 3 7,0
1X03 = drill 1.016 pad 1.88: 1 0,0; 2 2.54,0; 3 5.08,0
JST-2-SMD = smd 1 x 4.6: 1 -1,-3.7; 2 1,-3.7 | smd 1.6 x 3.4: NC1 -3.4,1.5; NC2 3.4,1.5
1X01 = drill 1.016 pad 1.88: 1 0,0
TACTILE_SWITCH_SMD_6.0X3.5MM = smd 2.3 x 1.6: 1 -3.15,0; 2 3.15,0
TACTILE_SWITCH_PTH_RIGHT_ANGLE_KIT = drill 0.8 pad 1.7: 1 -2.5,0; 2 2.5,0 | drill 1.2 pad 2.2: ANCHOR1 -3.5,2.5; ANCHOR2 3.5,2.5
SWITCH_SPDT_PTH_11.6X4.0MM = drill 1.016 pad 1.88: 1 0,2.54; 2 0,0; 3 0,-2.54
QFN-48 = smd 0.7 x 0.25: 1 -3.4,2.75; 2 -3.4,2.25; 3 -3.4,1.75; 4 -3.4,1.25; 5 -3.4,0.75; 6 -3.4,0.25; 7 -3.4,-0.25; 8 -3.4,-0.75; 9 -3.4,-1.25; 10 -3.4,-1.75; 11 -3.4,-2.25; 12 -3.4,-2.75; 25 3.4,-2.75; 26 3.4,-2.25; 27 3.4,-1.75; 28 3.4,-1.25; 29 3.4,-0.75; 30 3.4,-0.25; 31 3.4,0.25; 32 3.4,0.75; 33 3.4,1.25; 34 3.4,1.75; 35 3.4,2.25; 36 3.4,2.75 | smd 0.25 x 0.7: 13 -2.75,-3.4; 14 -2.25,-3.4; 15 -1.75,-3.4; 16 -1.25,-3.4; 17 -0.75,-3.4; 18 -0.25,-3.4; 19 0.25,-3.4; 20 0.75,-3.4; 21 1.25,-3.4; 22 1.75,-3.4; 23 2.25,-3.4; 24 2.75,-3.4; 37 2.75,3.4; 38 2.25,3.4; 39 1.75,3.4; 40 1.25,3.4; 41 0.75,3.4; 42 0.25,3.4; 43 -0.25,3.4; 44 -0.75,3.4; 45 -1.25,3.4; 46 -1.75,3.4; 47 -2.25,3.4; 48 -2.75,3.4 | smd 5.15 x 5.15: EP 0,0
SOT23-5 = smd 0.55 x 1.2: 1 -0.95,-1.3; 2 0,-1.3; 3 0.95,-1.3; 4 0.95,1.3; 5 -0.95,1.3
CRYSTAL-SMD-3.2X1.5MM = smd 1 x 1.8: P$1 -1.25,0; P$2 1.25,0

### Placement (x,y rotation side)
C1  27.94,27.94 0 top
C2  31.11,26.29 270 top
C3  25.4,27.94 0 top
C4  16.51,30.48 0 top
C5  16.51,25.4 0 top
C6  16.51,21.59 180 top
C7  24.13,8.89 270 top
C8  29.21,8.89 90 top
C9  17.91,5.84 180 top
C10  20.32,8.89 270 top
FB1  16.51,22.86 0 top
FRAME1  17.53,-13.46 0 top  (outside the outline)
J1  35.56,3.81 90 top
J2  5.08,8.13 0 top
J3  4.51,8.13 270 top
J4  46.99,25.4 90 top
J5  40.64,26.67 90 top
J6  29.21,36.83 0 top
J7  15.24,36.83 0 top
J8  46.99,2.54 90 top
J9  40.64,2.54 90 top
J10  15.24,1.27 0 top
J11  24.13,1.27 0 top
J12  46.74,17.78 270 top
J15  36.83,22.86 0 top
J16  36.83,25.4 0 top
R1  12.7,25.4 270 top
R2  15.24,8.89 90 top
S1  10.16,25.4 90 top
S2  38.35,16.51 270 top
S3  5.08,35.56 180 top
S4  2.54,25.4 270 top
S7  6.1,18.29 90 bottom
U1  26.67,21.59 0 top
U2  26.67,8.89 0 top
U3  17.78,8.89 0 top
Y2  16.51,27.94 180 top

### Tracks (layer width: path | path; a pad name or v marks a point on that pad's centre or on a via)
3.3V  (via drill 0.38)
  Top 0.254: R1.2 14.39,22.86 FB1.1 15.66,23.28 v16.51,24.13 | v31.75,27.94 31.75,27.5 C2.1 30.92,26.67 30.48,26.67 30.07,26.26 U1.36 | v24.13,31.75 24.82,31.06 C3.1 24.82,27.25 25.92,26.15 U1.44 | U1.17 25.92,14.47 v26.42,13.97 v31.75,13.97 | v24.13,11.18 C7.1 24.58,10.19 U2.5 25.72,11.24 25.91,11.43 29.21,11.43 30.48,10.16 41.66,10.16 v42.67,9.14
  Bottom 0.254: v16.51,24.13 20.32,24.13 21.59,25.4 21.59,30.48 22.86,31.75 v24.13,31.75 27.94,31.75 v31.75,27.94 v31.75,13.97 | v26.42,13.97 25.15,12.7 25.15,12.19 v24.13,11.18 | v42.67,9.14 42.67,1.52 41.66,0.51 36.96,0.51 J1.1
A0  (via drill 0.38)
  Top 0.254: U1.3 19.53,23.34 18.03,21.84 18.03,13.21 v19.05,12.19
  Bottom 0.254: J10.3 20.32,10.16 19.05,11.43 v19.05,12.19
A1  (via drill 0.38)
  Top 0.254: U1.7 21.09,21.34 20.83,21.08 v20.83,20.57 | v22.1,3.81 25.4,3.81 25.91,4.32 28.45,4.32 29.21,3.56 J11.3
  Bottom 0.254: v20.83,20.57 20.83,19.81 21.59,19.05 21.59,4.32 v22.1,3.81
A2  (via drill 0.38)
  Top 0.254: U1.8 22.36,20.84 21.59,20.07 21.59,19.56 21.08,19.05 v20.32,19.05
  Bottom 0.254: v20.32,19.05 17.4,19.05 16.89,19.56 14.73,19.56 12.7,21.59 12.7,30.48 11.94,31.24 5.59,31.24 2.58,34.25 S3.2
A3  (via drill 0.38)
  Top 0.254: U1.9 22.63,20.34 22.1,19.81 22.1,19.05 20.83,17.78 v19.3,17.78
  Bottom 0.254: S4.2 2.54,21.59 3.81,20.32 5.84,20.32 6.35,19.81 13.21,19.81 13.97,19.05 16.51,19.05 17.78,17.78 v19.3,17.78
D4  (via drill 0.38)
  Top 0.254: J5.3 46.34,31.75 J4.3 | U1.13 23.92,15.45 v24.13,15.24 | v27.94,15.24 v34.29,15.24
  Bottom 0.254: v24.13,15.24 v27.94,15.24 | v34.29,15.24 39.37,15.24 41.91,17.78 41.91,27.32 J4.3
D5  (via drill 0.38)
  Top 0.254: J5.2 46.68,29.21 J4.2 | U1.24 29.42,17.57 30.48,16.51 v34.29,16.51
  Bottom 0.254: v34.29,16.51 38.1,16.51 39.37,17.78 39.37,27.94 J5.2
D6  (via drill 0.38)
  Top 0.254: v35.31,13.97 35.31,16.76 35.81,17.27 35.81,20.83 35.31,21.34 32.77,21.34 32.27,20.84 U1.29 | J9.3 45.07,7.62 J8.3
  Bottom 0.254: v35.31,13.97 35.31,11.94 39.62,7.62 J9.3
D9
  Top 0.254: U1.12 22.65,18.84 22.1,18.29 22.1,17.27 21.59,16.76 21.59,14.73 23.37,12.95 36.58,12.95 36.83,12.7 38.71,12.7 38.86,12.85 S2.2
D10  (via drill 0.38)
  Top 0.254: J7.3 21.59,35.56 32,35.56 32.77,34.8 33.27,34.8 v33.53,34.54 | U1.27 32.99,19.84 v33.15,19.68
  Bottom 0.254: v33.15,19.68 33.15,30.1 33.78,30.73 33.78,33.02 33.66,33.15 33.53,33.27 v33.53,34.54
D11  (via drill 0.38)
  Top 0.254: J7.2 19.68,34.92 29.59,34.92 36.07,28.45 v38.61,28.45 | U1.25 30.69,18.84 31.75,17.78 v34.29,17.78
  Bottom 0.254: v34.29,17.78 37.59,17.78 38.61,19.05 v38.61,28.45
D12  (via drill 0.38)
  Top 0.254: 34.27,20.34 v34.29,20.32 34.04,20.57 32.77,20.57 32.53,20.34 U1.28
  Bottom 0.254: v34.29,20.32 J6.3
D13  (via drill 0.38)
  Top 0.254: U1.26 31.46,19.34 32,18.8 35.31,18.8 v35.05,19.05 | v33.02,35.81 33.27,35.81 33.78,35.31 34.29,35.31 35.05,34.54 v35.05,33.02
  Bottom 0.254: v35.05,19.05 v35.05,33.02 | J6.2 32.77,35.81 v33.02,35.81
GND  (via drill 0.38)
  Top 0.254: U1.5 19.55,22.34 18.54,21.34 18.54,14.22 v19.3,13.46 | U1.42 26.92,25.78 27.3,26.16 28.19,26.16 28.57,26.54 28.57,27.89 C1.2 28.52,28.76 28.19,29.08 26.42,29.08 25.98,28.65 C3.2 | C6.2 14.73,21.59 v14.35,21.97 | U1.35 30.95,23.84 31.11,24 C2.2 32.06,25.71 32.64,26.29 32.64,28.83 v31.5,29.97 | C4.1 15.93,31.06 v15.24,31.75 | U1.18 26.42,16.76 26.67,16.51 | C5.1 15.24,25.4 14.61,24.77 v14.35,24.38
  Bottom 0.254: v14.35,21.97 v14.35,24.38 | J7.1 v15.24,31.75
  other vias: 29.46,5.08 26.67,30.48 27.61,26.87 27.94,16.51 25.53,36.58 22.86,26.67 20.32,26.67 19.61,4.85 16.51,13.97 29.21,31.75 26.67,6.1 15.42,5.74 8.56,12.34
  pour Top (isolate 0.305): 0,0 50.8,0 50.8,38.1 0,38.1
  pour Bottom (isolate 0.305): 0,0 50.8,0 50.8,38.1 0,38.1
N$1
  Top 0.254: U3.5 15.69,10.19 R2.2
N$2  (via drill 0.38)
  Top 0.254: FB1.2 17.09,22.59 C6.1 17.09,20.5 v17.14,20.45 | v19.43,20.57 19.43,21.07 20.2,21.84 U1.6
  Bottom 0.254: v17.14,20.45 19.3,20.45 v19.43,20.57
N$3
  Top 0.254: U1.43 26.42,27 C1.1
N$4
  Top 0.254: Y2.P$2 15.37,28.05 15.37,29.08 15.75,29.46 17.02,29.46 17.02,30.41 C4.2 17.78,30.48 19.05,29.21 19.05,26.67 21.38,24.34 U1.1
N$5
  Top 0.254: U1.2 20.61,23.84 19.05,25.4 C5.2 17.76,26.07 Y2.P$1
RESET  (via drill 0.38)
  Top 0.254: R1.1 10.4,28.55 S1.2 10.16,30.48 12.7,33.02 29.21,33.02 30.48,31.75 30.48,27.94 v29.46,26.92 29.21,26.67 29.21,25.91 29.03,25.73 28.09,25.73 27.94,25.58 27.94,25.4 | J1.10 v29.21,6.35 | 27.94,25.4 27.92,25.38 U1.40 27.94,25.01 27.94,25.4
  Bottom 0.254: v29.21,6.35 29.21,25.91 29.46,26.16 v29.46,26.92
SCL
  Top 0.254: U1.32 31.99,22.34 35.05,25.4 J16.1
SDA
  Top 0.254: U1.31 32.25,21.84 33.27,22.86 J15.1
SWCLK  (via drill 0.38)
  Top 0.254: U1.45 25.42,25.81 24.64,26.59 24.21,26.59 22.86,27.94 v22.86,29.21
  Bottom 0.254: J1.4 33.02,2.54 30.48,5.08 30.48,27.94 29.21,29.21 v22.86,29.21
SWDIO  (via drill 0.38)
  Top 0.254: U1.46 24.92,25.63 24.77,25.78 23.24,25.78 v22.86,25.4
  Bottom 0.254: v22.86,25.4 22.86,3.81 24.13,2.54 30.48,2.54 31.75,1.27 J1.2
USB_D+  (via drill 0.38)
  Top 0.254: U1.34 31.21,23.34 33.66,25.78 33.66,29.34 29.34,33.66 12.32,33.66 7.62,28.96 7.62,21.59 v10.16,19.05 | J3.D+ 7.83,8.13 J2.D+
  Bottom 0.254: v10.16,19.05 10.16,11.47 9.08,10.39 J2.D+
USB_D-  (via drill 0.38)
  Top 0.254: U1.33 31.73,22.84 34.29,25.4 34.29,29.46 29.46,34.29 12.06,34.29 6.73,28.96 6.73,20.7 6.35,20.32 3.3,20.32 1.78,18.8 1.78,14.48 3.56,12.7 v4.32,12.7 | J2.D- 11.06,10.02 10.41,10.67 7.62,10.67 | J3.D- 7.25,8.78 7.62,9.14 7.62,10.67 | 7.62,10.67 v7.49,10.79
  Bottom 0.254: v4.32,12.7 5.59,11.43 6.86,11.43 v7.49,10.79
V_BATT
  Top 0.254: U3.3 18.73,5.87 C9.1 | S7.1 8.64,18.03
  Top 0.406: J12.2 43.04,13.83 40.64,11.43 30.48,11.43 29.72,12.19 23.37,12.19 22.86,11.68 22.86,7.62 21.08,5.84 C9.1 18.76,4.91 18.16,4.32 14.61,4.32 13.97,4.95 13.97,12.7 8.64,18.03
V_USB  (via drill 0.38)
  Top 0.254: J3.VBUS 6.13,9.43 v6.35,9.65
  Top 0.406: C10.1 19.87,10.19 U3.4 18.13,10.19 17.65,10.67 17.65,11.56 v17.53,11.68
  Bottom 0.254: 6.1,9.4 v6.35,9.65 | 11.08,6.86 J2.VBUS 10.92,6.74 | 3.56,9.65 3.81,9.4
  Bottom 0.406: v17.53,11.68 14.22,11.68 13.34,10.79 13.34,7.49 12.7,6.86 11.08,6.86 | 3.81,9.4 6.1,9.4 | S7.3 3.56,9.65 | v6.35,9.65 6.35,7.87 7.11,7.11 7.11,5.33 8.38,4.06 10.67,4.06 10.92,4.32 10.92,6.74
VIN  (via drill 0.38)  (1 unrouted)
  Top 0.254: 25.91,5.08 25.79,5.08 25.72,5.15 | J11.2 26.67,1.52 | v3.3,31.75 3.3,33.78 6.35,36.83 11.43,36.83 13.21,35.05 v18.03,35.05 | J5.4 38.35,32 33.78,32 v31.75,34.04
  Top 0.406: 17.78,3.56 14.22,3.56 13.21,4.57 13.21,12.19 11.43,13.97 9.91,13.97 6.1,17.78 | 17.78,3.56 19.56,3.56 | U2.1 25.72,5.15 | J10.2 17.78,3.56 | 26.67,1.52 25.4,2.79 20.32,2.79 19.56,3.56 | 35.63,8.31 C8.1 28.49,7.59 U2.3 27.62,5.52 27.18,5.08 25.91,5.08 25.4,4.57 20.57,4.57 19.56,3.56 | J9.2 46.03,5.08 J8.2
  Bottom 0.254: v3.3,31.75 1.02,29.46 1.02,20.57 1.78,19.81 4.57,19.81 S7.2 | 23.37,36.83 J7.4 21.08,35.05 v18.03,35.05 20.32,32.77 30.48,32.77 v31.75,34.04
  Bottom 0.406: J9.2 38.61,5.08 37.85,5.84 37.85,7.62 37.34,8.13 v35.81,8.13 | J8.2 49.28,8.33 49.28,33.78 47.16,35.9 J4.4 45.38,34.29 J5.4 39.37,34.29 J6.4

### Text on the board
Top: v01
tPlace: Vin | GND | D11 | D10 | Vin | GND | D13 | D12 | Vin | D4 | A2 | Reset | D5 | A3 | GND | - | USB | Vin | VBatt | Edgey | D9 | + | D6 | Vin | GND | Vin | A0 | GND | Vin | A1 | GND
bPlace: Vin | A2 | GND | D11 | D10 | Vin | GND | D13 | D12 | Vin | D4 | D5 | SCL | A3 | GND | SDA | D6 | Vin | GND | Vin | A0 | GND | Vin | A1 | GND